# EAGLE design SX2PC_free_v2-2 (EAGLE 8.5.1)
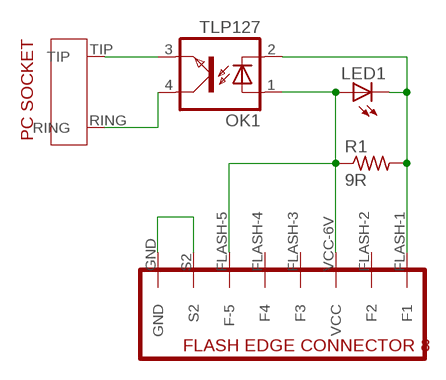
[diagram p0: schematic, sheet 1]

## Parts
LED1  LEDCHIP-LED0805  [CHIP-LED0805]
OK1  TLP127  [SO-4]
R1  9R  R-US_R0603  [R0603]
U$1  SX70-FLASH-EDGE8-MALE  [SX70-FLASH-EDGE8]
U$2  PC-SOCKET-KAISER-1311  [PC-SOCKET-KAISER-1311]

## Nets
GND: LED1.C OK1.2(C) R1.2 U$1.FLASH-1(F1)
N$1: U$1.GND U$1.S2
N$3: LED1.A OK1.1(A) R1.1 U$1.FLASH-5(F-5) U$1.VCC-6V(VCC)
N$4: OK1.3(EMIT) U$2.TIP
N$5: OK1.4(COL) U$2.RING
Unconnected: U$1.FLASH-2(F2) U$1.FLASH-3(F3) U$1.FLASH-4(F4)

## Library data of the parts
LED1 = led:LED: LED OSRAM: - CHIPLED LG R971, LG N971, LY N971, LG Q971, LY Q971, LO R971, LY R971 LH N974, LH R974 LS Q976, LO Q976, LY Q976 LO Q996 - Hyper CHIPLED LW Q18S LB Q993, LB Q99A, LB R99A - SideLED LS A670, LO A670, LY A670, LG A670, LP A670 LB A673, LV A673, LT A673, LW A673 LH A674 LY A675 LS A676, LA A676, LO A676, LY A676, LW A676 LS A679, LY A679, LG A679 - Hyper Micro SIDELED® LS Y876, LA Y876, LO Y876, LY Y876 LT Y87S - SmartLED LW L88C, LW L88S LB L89C, LB L89S, LG L890 LS L89K, LO L89K, LY L89K LS L896, LA L896, LO L896, LY L896 - TOPLED LS T670, LO T670, LY T670, LG T670, LP T670 LSG T670, LSP T670, LSY T670, LOP T670, LYG T670 LG T671, LOG T671, LSG T671 LB T673, LV T673, LT T673, LW T673 LH T674 LS T676, LA T676, LO T676, LY T676, LB T676, LH T676, LSB T676, LW T676 LB T67C, LV T67C, LT T67C, LS T67K, LO T67K, LY T67K, LW E67C LS E67B, LA E67B, LO E67B, LY E67B, LB E67C, LV E67C, LT E67C LW T67C LS T679, LY T679, LG T679 LS T770, LO T770, LY T770, LG T770, LP T770 LB T773, LV T773, LT T773, LW T773 LH T774 LS E675, LA E675, LY E675, LS T675 LS T776, LA T776, LO T776, LY T776, LB T776 LHGB T686 LT T68C, LB T68C - Hyper Mini TOPLED® LB M676 - Mini TOPLED Santana® LG M470 LS M47K, LO M47K, LY M47K Source: http://www.osram.convergy.de LUXEON: - LUMILED® LXK2-PW12-R00, LXK2-PW12-S00, LXK2-PW14-U00, LXK2-PW14-V00 LXK2-PM12-R00, LXK2-PM12-S00, LXK2-PM14-U00 LXK2-PE12-Q00, LXK2-PE12-R00, LXK2-PE12-S00, LXK2-PE14-T00, LXK2-PE14-U00 LXK2-PB12-K00, LXK2-PB12-L00, LXK2-PB12-M00, LXK2-PB14-N00, LXK2-PB14-P00, LXK2-PB14-Q00 LXK2-PR12-L00, LXK2-PR12-M00, LXK2-PR14-Q00, LXK2-PR14-R00 LXK2-PD12-Q00, LXK2-PD12-R00, LXK2-PD12-S00 LXK2-PH12-R00, LXK2-PH12-S00 LXK2-PL12-P00, LXK2-PL12-Q00, LXK2-PL12-R00 Source: www.luxeon.com KINGBRIGHT: KA-3528ASYC Source: www.kingbright.com
OK1 = openSX70:TLP127
R1 = rcl:R-US_: RESISTOR, American symbol
U$1 = openSX70:SX70-FLASH-EDGE8-MALE
U$2 = openSX70:PC-SOCKET-KAISER-1311

## Board
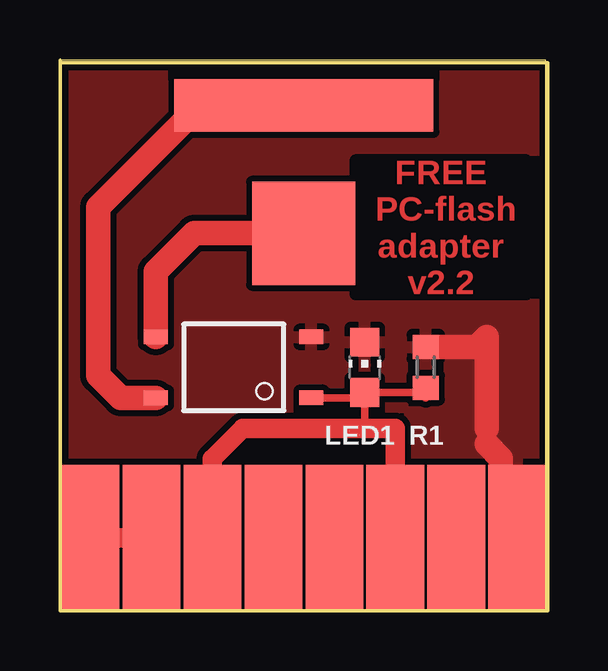
[diagram p1: board, top side]
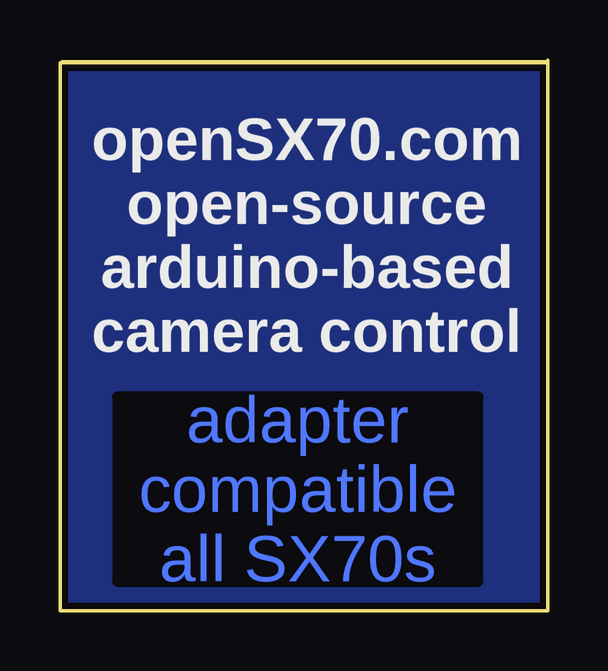
[diagram p2: board, bottom side, seen from below]

Size 20.32 x 22.98 mm. Coordinates in mm from the lower left corner, seen from the top.
Outline: 0,0 20.24,0 20.24,22.98 0,22.98 0,22.86
Outline: 0,22.86 0,0
Outline: 0,0 20.32,0 20.32,22.86 0,22.86
Copper layers (1*16): Top 0.035mm / dielectric 1.5mm / Bottom 0.035mm
Design rules "SparkFun": minimum track width 8mil, minimum drill 20mil, track to track 8mil, track to pad 8mil, pad to pad 8mil, via to via 8mil, smd to smd 8mil, copper to edge 10mil, drill to drill 8mil, minimum pad ring 12mil, minimum via ring 10mil, stop-mask expansion 4mil, vias tented up to drill 25mil, thermal gap 10mil

### Footprints (pad centres in the part's own frame; a part is rotated, then mirrored left to right if it is on the bottom)
CHIP-LED0805 = smd 1.2 x 1.2: A 0,-1.05; C 0,1.05
SO-4 = smd 1 x 0.6: 1 -3.24,0.635; 2 -3.24,-1.905; 3 3.24,-1.905; 4 3.24,0.635
R0603 = smd 1 x 1.1: 1 -0.85,0; 2 0.85,0
SX70-FLASH-EDGE8 = smd 2.4 x 6.09: FLASH-1 8.89,0.001; FLASH-2 6.35,0.001; FLASH-3 1.27,0.001; FLASH-4 -1.27,0.001; FLASH-5 -3.81,0.001; GND -8.89,0.001; S2 -6.35,0.001; VCC-6V 3.81,0.001
PC-SOCKET-KAISER-1311 = smd 10.8 x 2.2: RING 0,2.032 | smd 4.3 x 4.3: TIP 0,-3.302

### Placement (x,y rotation side)
LED1  12.7,10.16 0 top
OK1  7.24,9.53 180 top
R1  15.24,10.16 90 top
U$1  10.16,3.05 0 top
U$2  10.16,19.05 0 top

### Tracks (layer width: path | path; a pad name or v marks a point on that pad's centre or on a via)
GND
  Top 1.016: R1.2 17.36,11.01 17.78,11.43 17.78,7.62 | 17.78,6.96 18.37,6.37 18.37,5.76 18.72,5.41 18.72,3.38 U$1.FLASH-1
  pour Top (isolate 0.254): 0,22.86 20.32,22.86 20.32,0 0,0
  pour Bottom: 20.32,22.86 20.32,0 0,0 0,22.86
N$1
  Top 0.813: U$1.GND U$1.S2
N$3
  Top 0.305: 12.7,8.89 12.7,7.62 | 12.7,8.89 LED1.A 15.02,9.11 15.24,8.89 R1.1 | OK1.1 12.7,8.89 | U$1.FLASH-5
  Top 0.61: R1.1 15.04,9.11
  Top 0.813: U$1.FLASH-5 6.35,6.35 7.62,7.62 12.7,7.62 13.97,7.62 U$1.VCC-6V
N$4
  Top 1.016: OK1.3 4,14.16 5.59,15.75 U$2.TIP
N$5
  Top 1.016: OK1.4 2.54,8.89 1.6,9.83 1.6,16.84 6.02,21.26 11.43,21.26 11.25,21.08 U$2.RING

### Text on the board
Top: FREE / PC-flash / adapter / v2.2
Bottom: adapter / compatible / all SX70s
bPlace: openSX70.com / open-source / arduino-based / camera control